# EasyEDA Pro project SCH_and_PCB.epro, schematic 主板aht
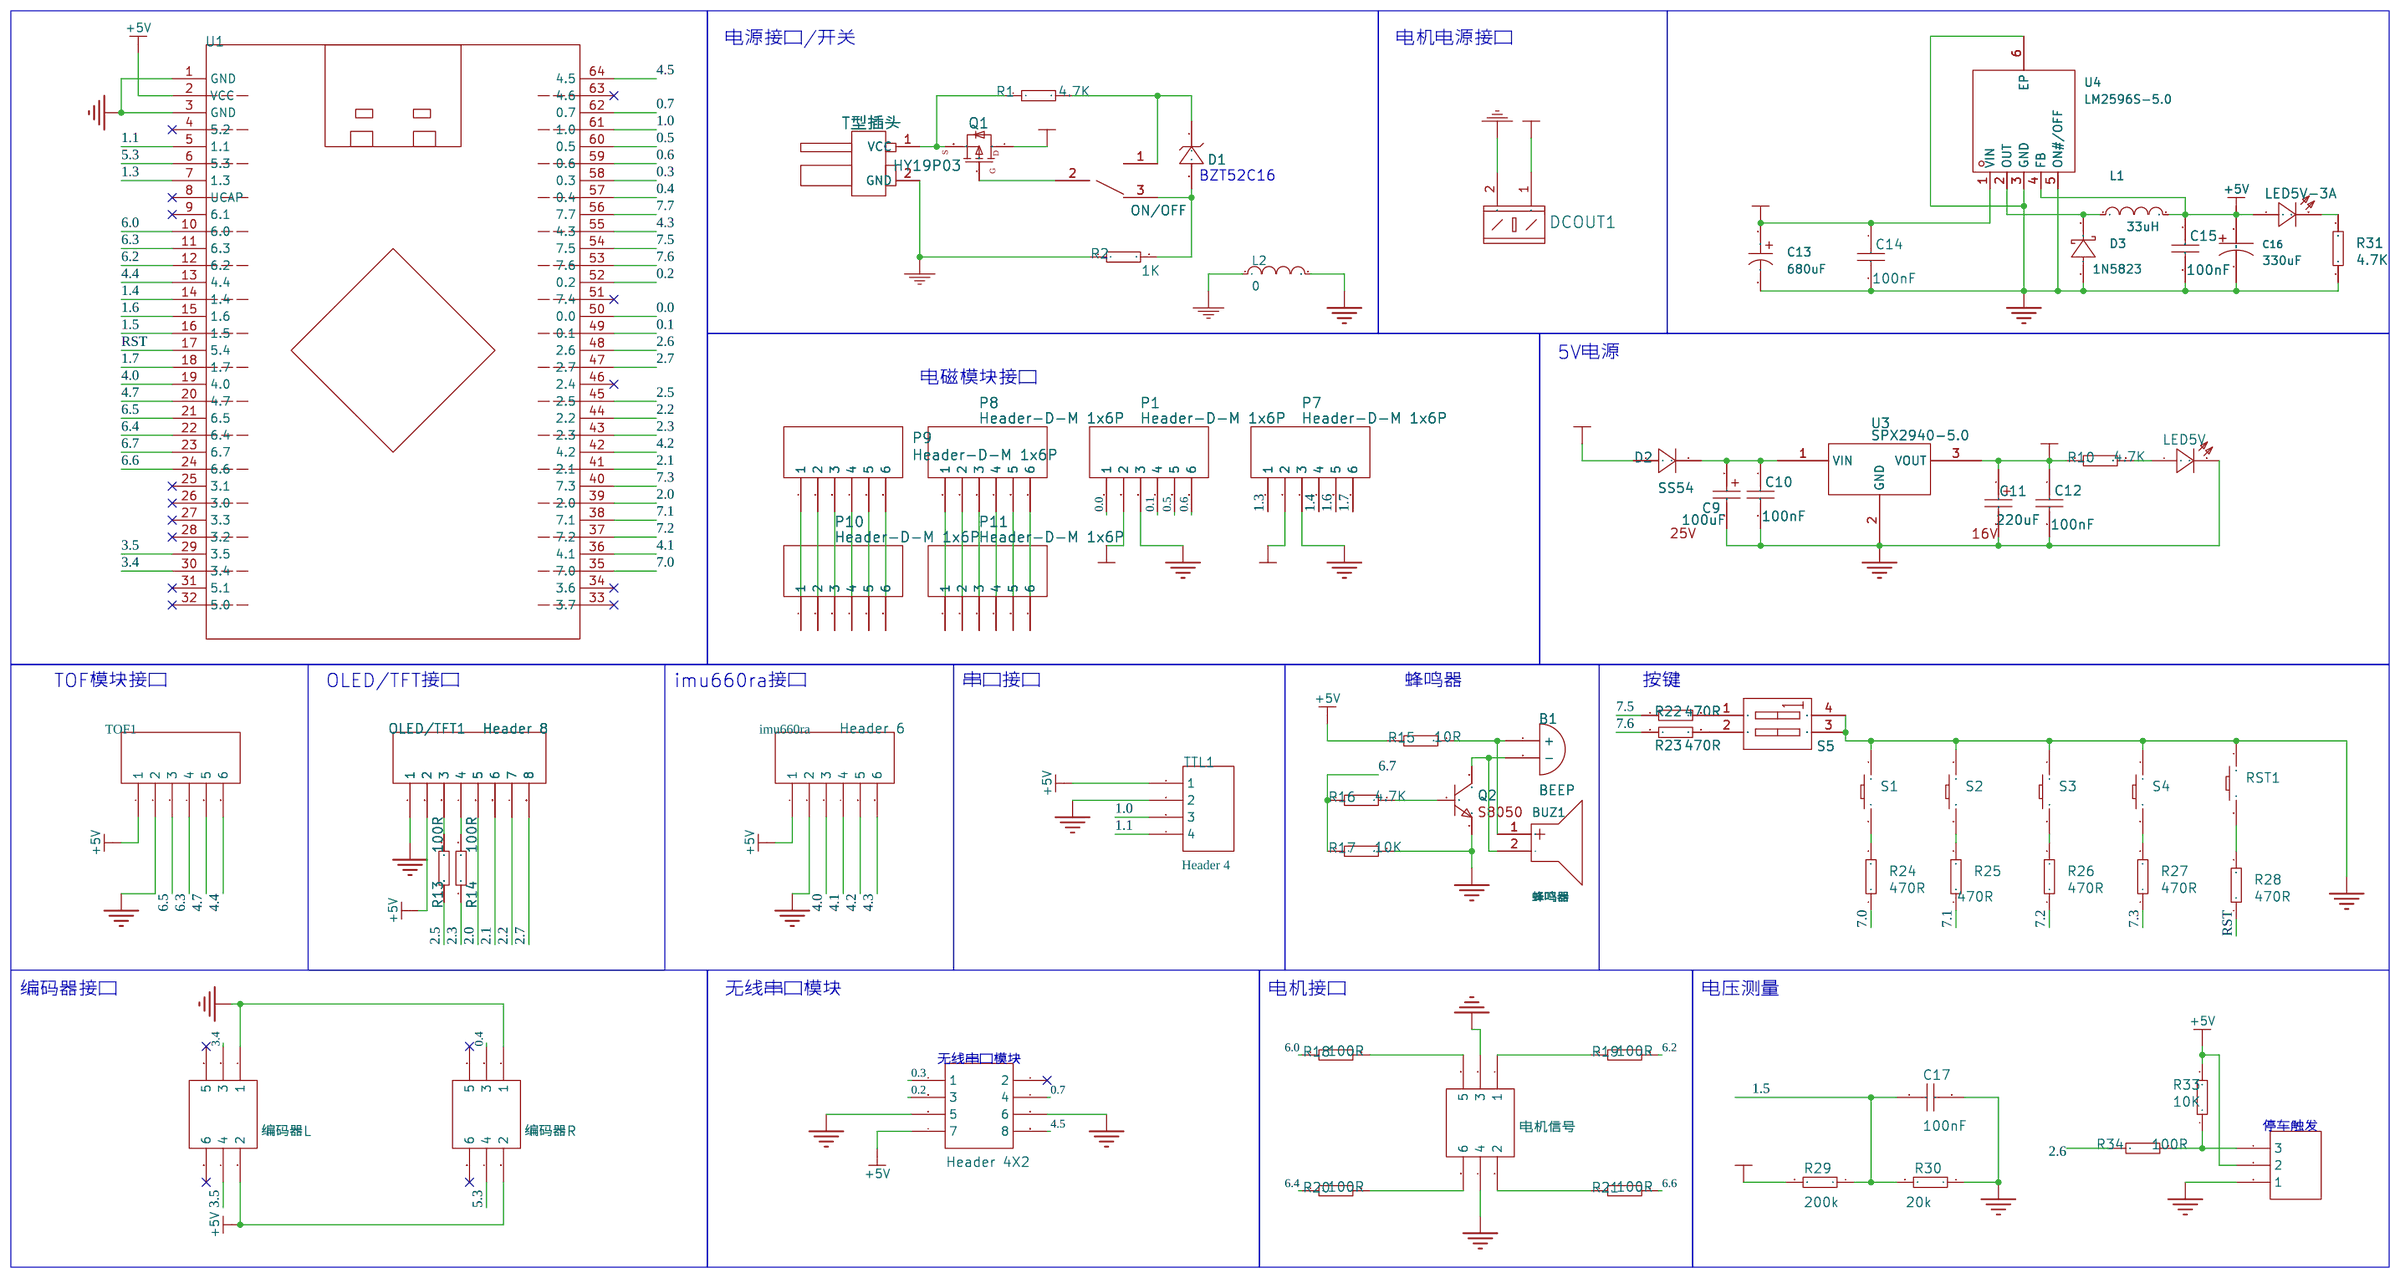
[diagram p2: schematic sheet]

## Parts
B1  BEEP  [蜂鸣器-直插-无源蜂鸣器]
BUZ1  蜂鸣器  [BUZ-TH_BD9.0-P5.00-D0.6-FD]
C9  100uF  [CAPS6.3]
C10  100nF  [C0805]
C11  220uF  [CAPS6.3]
C12  100nF  [C0805]
C13  680uF  [CAP-SMD_BD10.0-L10.3-W10.3-LS10.9-FD]
C14  100nF  [C0805]
C15  100nF  [C0805]
C16  330uF  [CAP-SMD_BD8.0-L8.3-W8.3-LS9.9-FD]
C17  100nF  [C0805]
D1  BZT52C16  [SOD-123-L]
D2  SS54  [SOD-123]
D3  1N5823  [DO-214AB_L6.9-W5.9-LS7.9-RD]
DCIN1  T型插头  [WIRED T-HEADER THROUGHHOLE]
DCOUT1  DCOUT1  [KF/WJ/DG 301-2P-5.0MM]
imu660ra  Header 6  [HDR1X6]
L1  33uH  [IND-SMD_L12.3-W12.3]
L2  0  [L0805]
LED5V  GREEN  [LED0805]
LED5V-3A  GREEN  [LED0805]
OLED/TFT1  Header 8  [HDR1X8]
ON/OFF  SW-SPDT  [SS12D10]
P1  Header-D-M 1x6P  [HDR1X6-M]
P7  Header-D-M 1x6P  [HDR1X6-M]
P8  Header-D-M 1x6P  [HDR1X6-M]
P9  Header-D-M 1x6P  [HDR1X6-M]
P10  Header-D-M 1x6P  [HDR1X6-M]
P11  Header-D-M 1x6P  [HDR1X6-M]
Q1  HY19P03  [TO-252AA]
Q2  S8050  [SOT-23]
R1  4.7K  [R0805]
R2  1K  [R0805]
R10  4.7K  [R0805]
R13  100R  [R0805]
R14  100R  [R0805]
R15  10R  [R0805]
R16  4.7K  [R0805]
R17  10K  [R0805]
R18  100R  [R0805]
R19  100R  [R0805]
R20  100R  [R0805]
R21  100R  [R0805]
R22  470R  [R0805]
R23  470R  [R0805]
R24  470R  [R0805]
R25  470R  [R0805]
R26  470R  [R0805]
R27  470R  [R0805]
R28  470R  [R0805]
R29  200k  [R0805]
R30  20k  [R0805]
R31  4.7K  [R0805]
R33  10K  [RESC1608[0603]S-N]
R34  100R  [RESC1608[0603]S-N]
RST1  Button  [PTS810-3*4-CURVEPIN]
S1  Button  [PTS810-3*4-CURVEPIN]
S2  Button  [PTS810-3*4-CURVEPIN]
S3  Button  [PTS810-3*4-CURVEPIN]
S4  Button  [PTS810-3*4-CURVEPIN]
S5  SW DIP-2  [DIP4]
STEER1  Header 3  [HDR1X3]
TOF1  Header 6  [HDR1X6]
TTL1  Header 4  [HDR1X4]
U1  STC16F40K128_CoreBoard  [STC16F40K128_COREBOARD]
U3  SPX2940-5.0  [TO-263-3]
U4  LM2596S-5.0  [TO-263-5_L10.2-W8.9-P1.70-BR]
无线串口模块3  Header 4X2  [HDR4X2_A1]
电机信号  电机信号  [HDR2X3]
编码器1  编码器L  [HDR2X3]
编码器2  编码器R  [HDR2X3]

## Library data of the parts
B1 = BEEP
BUZ1 = 蜂鸣器: Supplier Part: C9900020875; Supplier Footprint: 插件; JLCPCB Part Class: 扩展库; Supplier: LCSC
C9 = 100uF: Published: 8-Jun-2000; Revision: July-2002: Re-released for DXP Platform.; Publisher: Altium Limited; Price(RMB): 0.000; Voltage: 16V
C10 C12 C14 C15 C17 = 100nF: link: https://item.szlcsc.com/373011.html; 3DModel: C0805_L2.0-W1.3-H1.3; Published: 8-Jun-2000; Revision: July-2002: Re-released for DXP Platform.; Publisher: Altium Limited; Price(RMB): 0.000; Voltage: 50V; Tolerance: ±10%
C11 = 220uF: Published: 8-Jun-2000; Revision: July-2002: Re-released for DXP Platform.; Publisher: Altium Limited; Price(RMB): 0.000; Voltage: 16V
C13 = GVM1V681M1010: 容值:680uF;精度:±20%;额定电压:35V;纹波电流:1.19A@120Hz;等效串联电阻:60mΩ@120Hz;; LCSC Part Name: 680uF ±20% 35V; Supplier Part: C2980172; Manufacturer: HONOR(荣誉); Supplier Footprint: SMD,D10xL10.5mm; JLCPCB Part Class: 扩展库; Datasheet: https://atta.szlcsc.com/upload/public/pdf/source/20220509/EB2A569F0F3393644DE07704993C28AA.pdf; Supplier: LCSC; Tolerance: ±20%; Rated Voltage: 35V; Ripple Current: 1.19A@120Hz; Equivalent Series Resistance(ESR): 60mΩ@120Hz; φD: 10mm; L: 10.2mm; Lifetime @ Temp: 5000hrs@105℃; Operating Temperature: -55℃~+105℃
C16 = EEEFT1V331GP: 容值:330uF;精度:±20%;额定电压:35V;纹波电流:850mA@100kHz;等效串联电阻:80mΩ@100kHz;; LCSC Part Name: 330uF ±20% 35V; Supplier Part: C178599; Manufacturer: PANASONIC(松下); Supplier Footprint: SMD,D8xL10.2mm; JLCPCB Part Class: 扩展库; Datasheet: https://atta.szlcsc.com/upload/public/pdf/source/20180420/C190724_5C30A39F6DC8D73DF4133310F276C40B.pdf; Supplier: LCSC; Tolerance: ±20%; Rated Voltage: 35V; Ripple Current: 850mA@100kHz; Equivalent Series Resistance(ESR): 80mΩ@100kHz; φD: 8mm; L: 10.5mm; Lifetime @ Temp: 5000hrs@105℃; Operating Temperature: -55℃~+105℃
D1 = BZT52C16: Published: 8-Jun-2000; Publisher: Altium Limited; Price(RMB): 0.000; Imax: 500mA
D2 = SS54: Published: 8-Jun-2000; Revision: July-2002: Re-released for DXP Platform.; Publisher: Altium Limited; Price(RMB): 0.000; Imax: 500mA
D3 = 1N5823: 正向压降(Vf):470mV@15.7A;直流反向耐压(Vr):20V;平均整流电流(Io):5A;; LCSC Part Name: 电压:20V 电流:5A; Supplier Part: C3758715; Manufacturer: MICROCHIP(美国微芯); Supplier Footprint: 插件; JLCPCB Part Class: 扩展库; Datasheet: https://atta.szlcsc.com/upload/public/pdf/source/20240125/22047A7AC84D341540CAA01AAF413C30.pdf; Supplier: LCSC; Forward Voltage (Vf@If): 470mV@15.7A; Reverse Voltage (Vr): 20V; Average Rectified Current (Io): 5A
DCIN1 = T型插头
DCOUT1 = DCOUT1
imu660ra TOF1 = Header 6: LatestRevisionDate: 17-Jul-2002; LatestRevisionNote: Re-released for DXP Platform.; Publisher: Altium Limited; Price(RMB): 0.00
L1 = SMDRI127-330MT: 电感值:33uH;精度:±20%;额定电流:3A;饱和电流(Isat):5.5A;类型:屏蔽电感;; LCSC Part Name: 33uH ±20% 5.5A; Supplier Part: C9400; Manufacturer: SXN(顺翔诺); Supplier Footprint: SMD; JLCPCB Part Class: 扩展库; Datasheet: https://atta.szlcsc.com/upload/public/pdf/source/20210810/6F96FDC19AA308DD2AD166FFB9640E87.pdf; Supplier: LCSC; Tolerance: ±20%; Rated Current: 3A; Saturation Current (Isat): 5.5A; DC Resistance (DCR): 65mΩ; Type: 屏蔽电感
L2 = BLM21PG221SN1D: 标称阻抗@测试频率:220Ω@100MHz;误差:±25%;直流电阻(RDC):45mΩ;; LCSC Part Name: 单路 0805磁珠 阻抗220Ω@100MHz; Supplier Part: C85840; Manufacturer: muRata(村田); Supplier Footprint: 0805; JLCPCB Part Class: 扩展库; Datasheet: https://atta.szlcsc.com/upload/public/pdf/source/20180326/C118443_3FAC30E9A4F0E6B81275543C61E0685E.pdf; Supplier: LCSC; Impedance @ Frequency: 220Ω@100MHz; Tolerance: ±25%; DC Resistance: 45mΩ; Current Rating: 2A; Circuits: 1
LED5V LED5V-3A = GREEN: Published: 8-Jun-2000; Revision: July-2002: Re-released for DXP Platform.; Publisher: Altium Limited; Price(RMB): 0.00
OLED/TFT1 = Header 8: LatestRevisionDate: 17-Jul-2002; LatestRevisionNote: Re-released for DXP Platform.; Publisher: Altium Limited; Price(RMB): 0.00
ON/OFF = SW-SPDT: Published: 24-Mar-1999; Publisher: Altium Limited; Price(RMB): 0.000
P1 P7-P11 = Header-D-M 1x6P: Revision: V1.0
Q1 = HY19P03
Q2 = S8050: Published: 8-Jun-2000; Revision: July-2002: Re-released for DXP Platform.; Publisher: Altium Limited; Price(RMB): 0.000
R1 R10 R16 R31 = 4.7K: Published: 8-Jun-2000; Revision: July-2002: Re-released for DXP Platform.; Publisher: Altium Limited; Price(RMB): 0.000; Tolerance: ±1%
R2 = 1K: Published: 8-Jun-2000; Revision: July-2002: Re-released for DXP Platform.; Publisher: Altium Limited; Price(RMB): 0.000; Tolerance: ±1%
R13 R14 R18-R21 R34 = 100R: Published: 8-Jun-2000; Revision: July-2002: Re-released for DXP Platform.; Publisher: Altium Limited; Price(RMB): 0.000; Tolerance: ±1%
R15 = 10R: Published: 8-Jun-2000; Revision: July-2002: Re-released for DXP Platform.; Publisher: Altium Limited; Price(RMB): 0.000; Tolerance: ±1%
R17 R33 = 10K: Published: 8-Jun-2000; Revision: July-2002: Re-released for DXP Platform.; Publisher: Altium Limited; Price(RMB): 0.000; Tolerance: ±1%
R22-R30 = 470R: Published: 8-Jun-2000; Revision: July-2002: Re-released for DXP Platform.; Publisher: Altium Limited; Price(RMB): 0.000; Tolerance: ±1%
RST1 S1-S4 = Button: Published: 24-Mar-1999; Publisher: Altium Limited; Price(RMB): 0.000
S5 = SW DIP-2: Published: 24-Mar-1999; Revision: July-2002: Re-released for DXP Platform.; Publisher: Altium Limited; Price(RMB): 0.000
STEER1 = Header 3: LatestRevisionDate: 17-Jul-2002; LatestRevisionNote: Re-released for DXP Platform.; Publisher: Altium Limited; Price(RMB): 0.00
TTL1 = Header 4: LatestRevisionDate: 17-Jul-2002; LatestRevisionNote: Re-released for DXP Platform.; Publisher: Altium Limited; Price(RMB): 0.00
U1 = STC16F40K128_CoreBoard
U3 = SPX2940-5.0
U4 = LM2596S-5.0_C347421: 功能类型:降压型;输出类型:固定;输入电压:40V;输出电压:5V;输出电流(最大值):3A;; Supplier Part: C347421; Manufacturer: UMW(友台半导体); Supplier Footprint: TO-263-5; JLCPCB Part Class: 扩展库; Datasheet: https://atta.szlcsc.com/upload/public/pdf/source/20230506/0930E65C3A8B7B120C8A4D8E5A8AC327.pdf; Supplier: LCSC; Function: 降压型; Output Type: 固定; Input Voltage: 40V; Output Voltage: 5V; Output Current (Max): 3A; Switching Frequency: 150kHz; Operating Temperature: -40℃~+125℃@(TA); Synchronous Rectification: 否; Number of Outputs: 1; Topology: 降压式; Switch tube (built-in/external): 内置
无线串口模块3 = Header 4X2: LatestRevisionDate: 17-Jul-2002; LatestRevisionNote: Re-released for DXP Platform.; Publisher: Altium Limited; Price(RMB): 0.00
电机信号 = 电机信号: LatestRevisionDate: 17-Jul-2002; LatestRevisionNote: Re-released for DXP Platform.; Publisher: Altium Limited; Price(RMB): 0.00
编码器1 编码器2 = Header 3X2: LatestRevisionDate: 17-Jul-2002; LatestRevisionNote: Re-released for DXP Platform.; Publisher: Altium Limited; Price(RMB): 0.00

## Nets
+5V: C15.1 C16.1 imu660ra.1 L1.2 LED5V-3A.A OLED/TFT1.2 R15.1 R33.2 STEER1.2 TOF1.1 TTL1.1 U1.2(VCC) U4.4(FB) 无线串口模块3.7 编码器1.2 编码器2.2
GND: C9.2 C10.2 C11.2 C12.2 C13.2 C14.2 C15.2 C16.2 C17.2 D3.2(A) imu660ra.2 L2.2 LED5V.C OLED/TFT1.1 P1.3 P7.3 Q2.2(E) R17.2 R30.1 R31.1 RST1.1 S1.1 S2.1 S3.1 S4.1 S5.3(B2) S5.4(B1) STEER1.3(1) TOF1.2 TTL1.2 U1.1(GND) U1.3(GND) U3.2(GND) U4.3(GND) U4.5(ON#/OFF) U4.6(EP) 无线串口模块3.5 无线串口模块3.6 电机信号.3 电机信号.4 编码器1.1 编码器2.1
GND_BAT: DCIN1.2(GND) DCOUT1.2 L2.1 R2.1
VCC_5V: C11.1 C12.1 P1.2 P7.2 R10.1 U3.3(VOUT)
VCC_BAT: C13.1 C14.1 D2.A DCOUT1.1 Q1.1(D) R29.2 U4.1(VIN)
0.0: P1.1 U1.50(0.0)
0.1: P1.4 U1.49(0.1)
0.2: U1.52(0.2) 无线串口模块3.3
0.3: U1.58(0.3) 无线串口模块3.1
0.4: U1.57(0.4) 编码器2.3
0.5: P1.5 U1.60(0.5)
0.6: P1.6 U1.59(0.6)
0.7: U1.62(0.7) 无线串口模块3.4
1.0: TTL1.3 U1.61(1.0)
1.1: TTL1.4 U1.5(1.1)
1.3: P7.1 U1.7(1.3)
1.4: P7.4 U1.14(1.4)
1.5: C17.1 R29.1 R30.2 U1.16(1.5)
1.6: P7.5 U1.15(1.6)
1.7: P7.6 U1.18(1.7)
2.0: OLED/TFT1.5 U1.39(2.0)
2.1: OLED/TFT1.6 U1.41(2.1)
2.2: OLED/TFT1.7 U1.44(2.2)
2.3: R14.1 U1.43(2.3)
2.5: R13.1 U1.45(2.5)
2.6: R34.1 U1.48(2.6)
2.7: OLED/TFT1.8 U1.47(2.7)
3.4: U1.30(3.4) 编码器1.3
3.5: U1.29(3.5) 编码器1.4
4.0: imu660ra.3 U1.19(4.0)
4.1: imu660ra.4 U1.36(4.1)
4.2: imu660ra.5 U1.42(4.2)
4.3: imu660ra.6 U1.55(4.3)
4.4: TOF1.6 U1.13(4.4)
4.5: U1.64(4.5) 无线串口模块3.8
4.7: TOF1.5 U1.20(4.7)
5.3: U1.6(5.3) 编码器2.4
6.0: R18.1 U1.10(6.0)
6.2: R19.2 U1.12(6.2)
6.3: TOF1.4 U1.11(6.3)
6.4: R20.1 U1.22(6.4)
6.5: TOF1.3 U1.21(6.5)
6.6: R21.2 U1.24(6.6)
6.7: R16.1 R17.1 U1.23(6.7)
7.0: R24.1 U1.35(7.0)
7.1: R25.1 U1.38(7.1)
7.2: R26.1 U1.37(7.2)
7.3: R27.1 U1.40(7.3)
7.5: R22.1 U1.54(7.5)
7.6: R23.1 U1.53(7.6)
7.7: U1.56(7.7)
RST: R28.1 U1.17(5.4)
$1N828: C9.1 C10.1 D2.K U3.1(VIN)
$1N831: LED5V.A R10.2
$1N927: OLED/TFT1.3 R13.2
$1N930: OLED/TFT1.4 R14.2
$1N1043: Q2.1(B) R16.2
$1N1188: R20.2 电机信号.6
$1N1189: R21.1 电机信号.2
$1N1190: R18.2 电机信号.5
$1N1191: R19.1 电机信号.1
$1N1401: DCIN1.1(VCC) Q1.3(S) R1.1
$1N1404: D1.K ON/OFF.1 R1.2
$1N1405: D1.A ON/OFF.3 R2.2
$1N1408: ON/OFF.2 Q1.2(G)
$1N1624: R22.2 S5.1(A1)
$1N1625: R23.2 S5.2(A2)
$1N1628: R24.2 S1.2
$1N1629: R25.2 S2.2
$1N1630: R26.2 S3.2
$1N1631: R27.2 S4.2
$1N1632: R28.2 RST1.2
$1N8370: P9.1 P10.1
$1N8373: P9.2 P10.2
$1N8376: P9.3 P10.3
$1N8379: P9.4 P10.4
$1N8382: P9.5 P10.5
$1N8385: P9.6 P10.6
$1N8391: P8.1 P11.1
$1N8394: P8.2 P11.2
$1N8397: P8.3 P11.3
$1N8400: P8.4 P11.4
$1N8403: P8.5 P11.5
$1N8406: P8.6 P11.6
$1N13953: D3.1(K) L1.1 U4.2(OUT)
$1N14454: LED5V-3A.C R31.2
$1N16658: R33.1 R34.2 STEER1.1(3)
$1N16761: B1.1(+) BUZ1.1(+) R15.2
$1N16768: B1.2(-) BUZ1.2(-) Q2.3(C)

Not connected (* = marked no-connect by the designer): U1 4(5.2)* 8(UCAP)* 9(6.1)* 25(3.1)* 26(3.0)* 27(3.3)* 28(3.2)* 31(5.1)* 32(5.0)* 33(3.7)* 34(3.6)* 46(2.4)* 51(7.4)* 63(4.6)*; 无线串口模块3 2*; 编码器1 5* 6*; 编码器2 5* 6*

## Notes on the sheet
- 电源接口/开关
- 电机电源接口
- BZT52C16
- 5V电源
- 电磁模块接口
- TOF模块接口
- OLED/TFT接口
- imu660ra接口
- 串口接口
- 蜂鸣器
- 按键
- 编码器接口
- 无线串口模块
- 电机接口
- 电压测量
- 无线串口模块
- 停车触发
